# EAGLE design NANOEveryV3.0 (EAGLE 9.4.2)
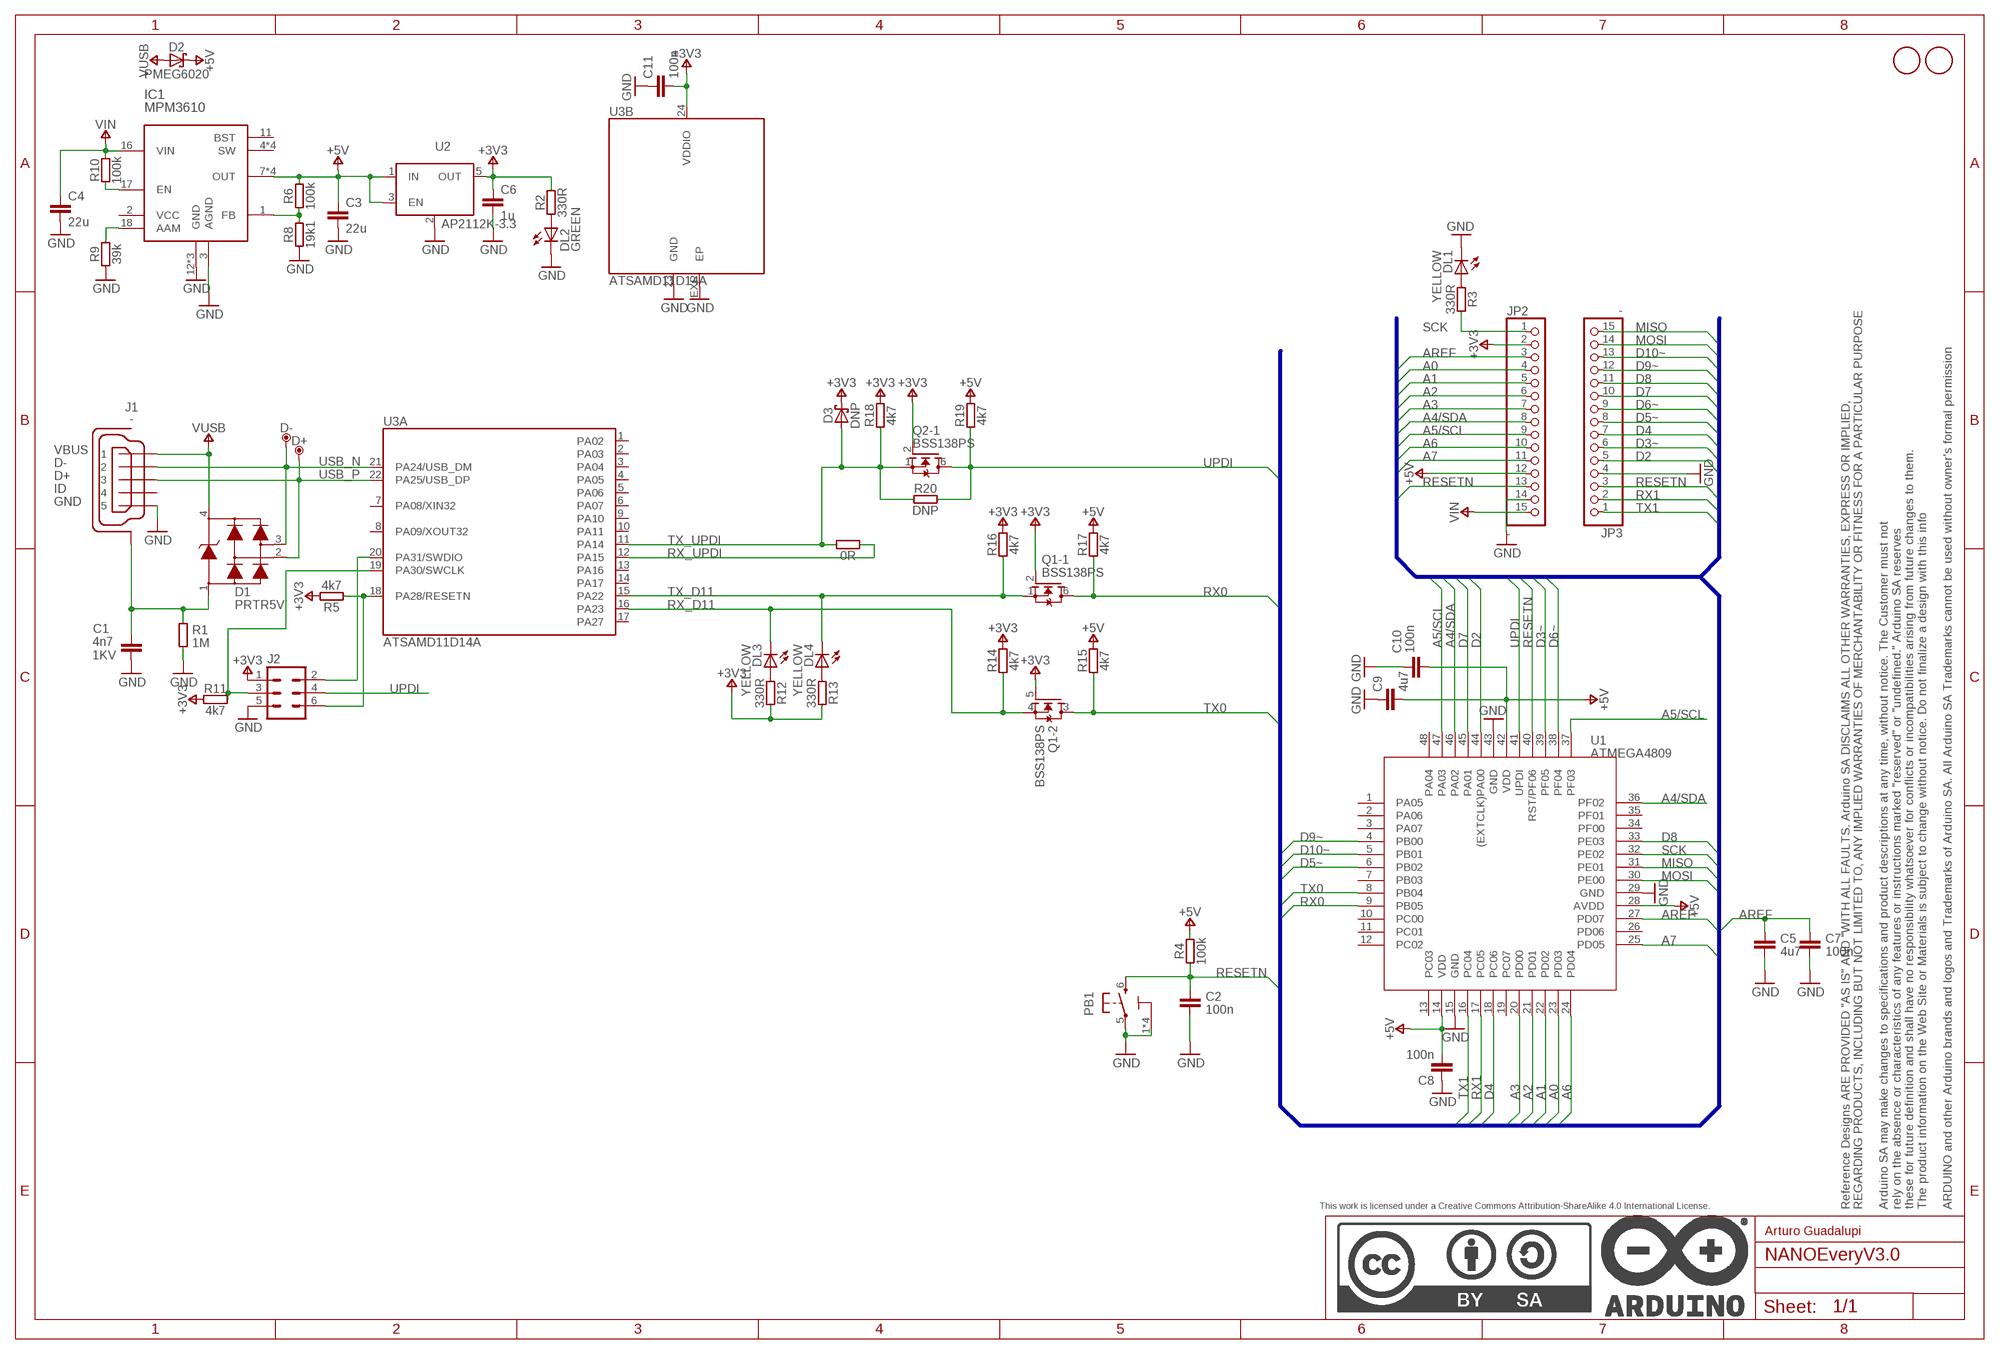
[diagram p0: schematic, sheet 1]

## Parts
C1  4n7  C4.7NF-0805  [0805-R2013X50N]
C2  100n  C-100NF-0402  [0402-1005X55N]
C3  22u  C-22U-0805  [0805-R2013X50N]
C4  22u  C-22U-0805  [0805-R2013X50N]
C5  4u7  C-4.7UF-0402  [0402-1005X55N]
C6  1u  C-1UF-0402  [0402-1005X55N]
C7  100n  C-100NF-0402  [0402-1005X55N]
C8  100n  C-100NF-0402  [0402-1005X55N]
C9  4u7  C-4.7UF-0402  [0402-1005X55N]
C10  100n  C-100NF-0402  [0402-1005X55N]
C11  100n  C-100NF-0402  [0402-1005X55N]
D1  PRTR5V  PRTR5V0U2X,215  [SOT190P230X110-4N]
D2  PMEG6020  PMEG6020AELRX  [SODFL3517X110N]
D3  DNP  PMEG6020AELRX-DNP  [SODFL3517X110N]
D+  DNP  TPTP-1.00MM  [TP-1.00MM]
D-  DNP  TPTP-1.00MM  [TP-1.00MM]
DL1  YELLOW  LED-YELLOW-0603  [LEDC1608X80N-AK]
DL2  GREEN  LED-GREEN-0603  [LEDC1608X80N-AK]
DL3  YELLOW  LED-YELLOW-0603  [LEDC1608X80N-AK]
DL4  YELLOW  LED-YELLOW-0603  [LEDC1608X80N-AK]
FD1  DNP  FIDUCIAL-1.5MM  [FD-1-1.5]
FD2  DNP  FIDUCIAL-1.5MM  [FD-1-1.5]
FRAME1  DNP  A3-FRAME  [FRAME]
IC1  MPM3610  [MPM3610]
J1  -  USB-MICRO  [ZX62-AB-5PA]
J2  DNP  PINHD-2X03-SMTP  [2X03-TP]
JP2  -  PINHD-1X15-CASTELLATED  [1X15-CASTELL]
JP3  -  PINHD-1X15-CASTELLATED  [1X15-CASTELL]
PB1  PTS820  TACTILE1PTS820-NH  [C&K_PTS820_NO_HOLES]
Q1  BSS138PS  [SOT363]
Q2  BSS138PS  [SOT363]
R1  1M  R-1M-0402  [0402-1005X55N]
R2  330R  R-330R-0402  [0402-1005X55N]
R3  330R  R-330R-0402  [0402-1005X55N]
R4  100k  R-100K-0402  [0402-1005X55N]
R5  4k7  R-4K7-0402  [0402-1005X55N]
R6  100k  R-100K-0402  [0402-1005X55N]
R7  0R  R-0R-0402  [0402-1005X55N]
R8  19k1  R-19K1-0402  [0402-1005X55N]
R9  39k  R-39K-0402  [0402-1005X55N]
R10  100k  R-100K-0402  [0402-1005X55N]
R11  4k7  R-4K7-0402  [0402-1005X55N]
R12  330R  R-330R-0402  [0402-1005X55N]
R13  330R  R-330R-0402  [0402-1005X55N]
R14  4k7  R-4K7-0402  [0402-1005X55N]
R15  4k7  R-4K7-0402  [0402-1005X55N]
R16  4k7  R-4K7-0402  [0402-1005X55N]
R17  4k7  R-4K7-0402  [0402-1005X55N]
R18  4k7  R-4K7-0402  [0402-1005X55N]
R19  4k7  R-4K7-0402  [0402-1005X55N]
R20  DNP  R-DNP-0402  [0402-1005X55N]
U1  ATMEGA4809  [TQFP48]
U2  AP2112K-3.3  [SOT25]
U3  ATSAMD11D14A  ATSAMD11D14  [HVQFN24]

## Nets
+3V3: C6.1 C11.2 D3.C J2.1 JP2.2 Q1.2(-1:G) Q1.5(-2:G) Q2.2(-1:G) R2.2 R5.2 R11.1 R12.2 R13.2 R14.2 R16.2 R18.2 U2.5(OUT) U3.24(B:VDDIO)
+5V: C3.1 C8.2 C9.2 C10.2 D2.C IC1.7(OUT) IC1.8(OUT) IC1.9(OUT) IC1.20(OUT) JP2.12 R4.2 R6.2 R15.2 R17.2 R19.2 U1.14(VDD) U1.28(AVDD) U1.42(VDD) U2.1(IN) U2.3(EN)
A0: JP2.4 U1.23(PD03)
A1: JP2.5 U1.22(PD02)
A2: JP2.6 U1.21(PD01)
A3: JP2.7 U1.20(PD00)
A4/SDA: JP2.8 U1.36(PF02) U1.46(PA02)
A5/SCL: JP2.9 U1.37(PF03) U1.47(PA03)
A6: JP2.10 U1.24(PD04)
A7: JP2.11 U1.25(PD05)
AREF: C5.1 C7.1 JP2.3 U1.27(PD07)
D2: JP3.5 U1.44((EXTCLK)PA00)
D3~: JP3.6 U1.39(PF05)
D4: JP3.7 U1.18(PC06)
D5~: JP3.8 U1.6(PB02)
D6~: JP3.9 U1.38(PF04)
D7: JP3.10 U1.45(PA01)
D8: JP3.11 U1.33(PE03)
D9~: JP3.12 U1.4(PB00)
D10~: JP3.13 U1.5(PB01)
D11_RESET: J2.6 R5.1 U3.18(A:PA28/RESETN)
D11_SWCLK: J2.3 R11.2 U3.19(A:PA30/SWCLK)
D11_SWDIO: J2.2 U3.20(A:PA31/SWDIO)
GND: C1.2 C2.2 C3.2 C4.2 C5.2 C6.2 C7.2 C8.1 C9.1 C10.1 C11.1 DL1.C DL2.C IC1.3(AGND) IC1.12(GND) IC1.13(GND) IC1.14(GND) J1.5 J2.5 JP2.14 JP3.4 PB1.1 PB1.2 PB1.3 PB1.4 PB1.5 R1.1 R8.1 R9.1 U1.15(GND) U1.29(GND) U1.43(GND) U2.2(GND/ADJ) U3.23(B:GND) U3.EXP(B:EP)
MISO: JP3.15 U1.31(PE01)
MOSI: JP3.14 U1.30(PE00)
N$1: C1.1 D1.1 J1.6(SH) J1.7(SH) J1.8(SH) J1.9(SH) J1.10(SH) J1.11(SH) R1.2
N$2: DL2.A R2.1
N$3: DL1.A R3.1
N$5: IC1.1(FB) R6.1 R8.2
N$6: IC1.18(AAM) R9.2
N$7: IC1.17(EN) R10.1
N$11: DL3.A R12.1
N$12: DL4.A R13.1
RESETN: C2.1 JP2.13 JP3.3 PB1.6 R4.1 U1.40(RST/PF06)
RX0: Q1.6(-1:D) R17.1 U1.9(PB05)
RX1: JP3.2 U1.17(PC05)
RX_D11: DL3.C Q1.4(-2:S) R14.1 U3.16(A:PA23)
RX_UPDI: R7.2 U3.12(A:PA15)
SCK: JP2.1 R3.2 U1.32(PE02)
TX0: Q1.3(-2:D) R15.1 U1.8(PB04)
TX1: JP3.1 U1.16(PC04)
TX_D11: DL4.C Q1.1(-1:S) R16.1 U3.15(A:PA22)
TX_UPDI: D3.A Q2.1(-1:S) R7.1 R18.1 R20.1 U3.11(A:PA14)
UPDI: J2.4 Q2.6(-1:D) R19.1 R20.2 U1.41(UPDI)
USB_N [usb]: D1.3 D-.X J1.2 U3.21(A:PA24/USB_DM)
USB_P [usb]: D1.2 D+.X J1.3 U3.22(A:PA25/USB_DP)
VIN: C4.1 IC1.16(VIN) JP2.15 R10.2
VUSB: D1.4 D2.A J1.1
Unconnected: IC1.2(VCC) IC1.4(SW) IC1.5(SW) IC1.6(SW) IC1.11(BST) IC1.19(SW) J1.4 Q2.3(-2:D) Q2.4(-2:S) Q2.5(-2:G) U1.1(PA05) U1.2(PA06) U1.3(PA07) U1.7(PB03) U1.10(PC00) U1.11(PC01) U1.12(PC02) U1.13(PC03) U1.19(PC07) U1.26(PD06) U1.34(PF00) U1.35(PF01) U1.48(PA04) U3.1(A:PA02) U3.2(A:PA03) U3.3(A:PA04) U3.4(A:PA05) U3.5(A:PA06) U3.6(A:PA07) U3.7(A:PA08/XIN32) U3.8(A:PA09/XOUT32) U3.9(A:PA10) U3.10(A:PA11) U3.13(A:PA16) U3.14(A:PA17) U3.17(A:PA27)

## Buses
A0,A1,A2,A3,A4/SDA,A5/SCL,A6,A7,AREF,D2,D3~,D4,D5~,D6~,D7,D8,D9~,D10~,MISO,MOSI,RESETN,RX0,RX1,SCK,TX1,UPDI,VIN

## Notes on the sheet
- Arturo Guadalupi

## Library data of the parts
C1 = Arduino-rcl:C: SMD Capacitor; CODE-ARDUINO: 0689; DATASHEET: http://www.kemet.com/Lists/ProductCatalog/Attachments/40/KEM_C1010_X7R_HV_SMD.pdf; DISTRIBUTOR-LINK: www.kemet.com/docfinder?Partnumber=C0805C472KDRACTU; DISTRIBUTOR-PN: 399-6738-1-ND; MANUFACTURER: Kemet; MANUFACTURER-PN: C0805C472KDRACTU; NOTE: -; VOLTAGE: 1KV
C2 C7 C8 C10 C11 = Arduino-rcl:C: SMD Capacitor; CODE-ARDUINO: 0132; DATASHEET: http://www.tdk.com/pdf/TDKMLCCCapRange.pdf; DISTRIBUTOR-LINK: http://www.digikey.com/product-detail/en/tdk-corporation/C1005X5R1H104K050BB/445-5942-1-ND/2443982; DISTRIBUTOR-PN: 445-5942-1-ND; MANUFACTURER: TDK; MANUFACTURER-PN: C1005X5R1H104K050BB; NOTE: -
C3 C4 = Arduino-rcl:C: SMD Capacitor; CODE-ARDUINO: 2233; DATASHEET: https://media.digikey.com/pdf/Data%20Sheets/Samsung%20PDFs/CL21A226MQCLQNC_character.pdf; DISTRIBUTOR-LINK: https://www.digikey.com/product-detail/en/samsung-electro-mechanics-america-inc/CL21A226MQCLQNC/1276-2412-1-ND/3890498; DISTRIBUTOR-PN: 1276-2412-1-ND; MANUFACTURER: Samsung; MANUFACTURER-PN: CL21A226MQCLQNC; NOTE: -
C5 C9 = Arduino-rcl:C: SMD Capacitor; CODE-ARDUINO: 0833; DATASHEET: http://search.murata.co.jp/Ceramy/image/img/A01X/partnumbering_e_01.pdf; DISTRIBUTOR-LINK: http://www.digikey.com/product-detail/en/murata-electronics-north-america/GRM155R60J475ME47D/490-5915-1-ND/3719860; DISTRIBUTOR-PN: 490-5915-1-ND; MANUFACTURER: Murata; MANUFACTURER-PN: GRM155R60J475ME47D; NOTE: -
C6 = Arduino-rcl:C: SMD Capacitor; CODE-ARDUINO: 0133; DATASHEET: http://search.murata.co.jp/Ceramy/image/img/A01X/partnumbering_e_01.pdf; DISTRIBUTOR-LINK: http://www.digikey.com/product-detail/en/murata-electronics-north-america/GRM155R61E105KA12D/490-10017-1-ND/5026367; DISTRIBUTOR-PN: 490-10017-1-ND; MANUFACTURER: Murata; MANUFACTURER-PN: GRM155R61E105KA12D; NOTE: -
D1 = Arduino-diodes:PRTR5V0U2X,215: USB ESD protection; CODE-ARDUINO: 2209; DATASHEET: http://www.nxp.com/documents/data_sheet/PRTR5V0U2X.pdf; DISTRIBUTOR-LINK: http://www.digikey.com/product-detail/en/nxp-semiconductors/PRTR5V0U2X,215/568-4140-1-ND/1589981; DISTRIBUTOR-PN: 568-4140-1-ND; MANUFACTURER: NXP; MANUFACTURER-PN: PRTR5V0U2X,215
D2 = Arduino-diodes:PMEG6020AELRX: 60 V, 2 A low leakage current Schottky barrier rectifier Datasheet <http://www.nxp.com/documents/data_sheet/PMEG6020AELR.pdf>; CODE-ARDUINO: 2208; DATASHEET: http://www.nxp.com/documents/data_sheet/PMEG6020AELR.pdf; DISTRIBUTOR-LINK: http://www.digikey.com/products/en?keywords=%20568-12710-1-ND; DISTRIBUTOR-PN: 568-12710-1-ND; MANUFACTURER: NXP; MANUFACTURER-PN: PMEG6020AELRX
D3 = Arduino-diodes:PMEG6020AELRX: 60 V, 2 A low leakage current Schottky barrier rectifier Datasheet <http://www.nxp.com/documents/data_sheet/PMEG6020AELR.pdf>; CODE-ARDUINO: DNP; DATASHEET: DNP; DISTRIBUTOR-LINK: DNP; DISTRIBUTOR-PN: DNP; MANUFACTURER: DNP; MANUFACTURER-PN: DNP
D+ D- = Arduino-utility:TP: Testpoint; CODE-ARDUINO: DNP; DATASHEET: DNP; DISTRIBUTOR-LINK: DNP; DISTRIBUTOR-PN: DNP; MANUFACTURER: DNP; MANUFACTURER-PN: DNP
DL1 DL3 DL4 = Arduino-diodes:LED: LED; CODE-ARDUINO: 2243; DATASHEET: http://media.digikey.com/pdf/Data%20Sheets/Avago%20PDFs/HSMz-Czzz.pdf; DISTRIBUTOR-LINK: http://www.digikey.com/product-detail/en/broadcom-limited/HSMY-C190/516-1424-1-ND/637748; DISTRIBUTOR-PN: 516-1424-1-ND; MANUFACTURER: Avago; MANUFACTURER-PN: HSMY-C190
DL2 = Arduino-diodes:LED: LED; CODE-ARDUINO: 2204; DATASHEET: http://media.digikey.com/pdf/Data%20Sheets/Avago%20PDFs/HSMz-Czzz.pdf; DISTRIBUTOR-LINK: http://www.digikey.com/product-detail/en/broadcom-limited/HSMG-C190/516-1425-1-ND/637749; DISTRIBUTOR-PN: 516-1425-1-ND; MANUFACTURER: Avago; MANUFACTURER-PN: HSMG-C190
FD1 FD2 = Arduino-utility:FIDUCIAL: Fiducial mount; CODE-ARDUINO: DNP; DATASHEET: DNP; DISTRIBUTOR-LINK: DNP; DISTRIBUTOR-PN: DNP; MANUFACTURER: DNP; MANUFACTURER-PN: DNP
FRAME1 = Arduino-utility:A3-FRAME; CODE-ARDUINO: DNP; DATASHEET: DNP; DISTRIBUTOR-LINK: DNP; DISTRIBUTOR-PN: DNP; MANUFACTURER: DNP; MANUFACTURER-PN: DNP; NOTE: DNP
IC1 = Arduino-ICs:MPM3610: MPM3610 Step Down Regulator; CODE-ARDUINO: 2093; DATASHEET: https://www.monolithicpower.com/pub/media/document/MPM3610_r1.01.pdf; DISTRIBUTOR-LINK: https://www.digikey.com/product-detail/en/monolithic-power-systems-inc/MPM3610AGQV-P/1589-1249-1-ND/5298336; DISTRIBUTOR-PN: 1589-1249-1-ND; MANUFACTURER: MPS; MANUFACTURER-PN: MPM3610AGQV-P; RESTRICTIONS: NO
J1 = Arduino-connectors:USB-MICRO: USB - micro AB USB 2.0 Receptacle Connector 5 Position Surface Mount, Right Angle, Horizontal; CODE-ARDUINO: 2219; DATASHEET: https://www.hirose.com/product/en/download_file/key_name/ZX/category/Catalog/doc_file_id/31704/?file_category_id=4&item_id=13&is_series=1; DISTRIBUTOR-LINK: http://www.digikey.com/product-detail/en/hirose-electric-co-ltd/ZX62-AB-5PA(31)/H125279CT-ND/5994741; DISTRIBUTOR-PN: H125279CT-ND; MANUFACTURER: Hirose; MANUFACTURER-PN: ZX62-AB-5PA(31)
J2 = Arduino-connectors:PINHD-2X03-SM: PIN HEADER; CODE-ARDUINO: DNP; DATASHEET: DNP; DISTRIBUTOR-LINK: DNP; DISTRIBUTOR-PN: DNP; MANUFACTURER: DNP; MANUFACTURER-PN: DNP; NOTE: DNP
JP2 JP3 = Arduino-connectors:PINHD-1X15: PIN HEADER; CODE-ARDUINO: 0646; DATASHEET: -; DISTRIBUTOR-LINK: -; DISTRIBUTOR-PN: -; MANUFACTURER: -; MANUFACTURER-PN: -; NOTE: DNM
PB1 = Arduino-pushbuttons:TACTILE1: Tactile Switch SPST-NO Top Actuated Surface Mount; CODE-ARDUINO: 0173; DATASHEET: http://www.ckswitches.com/media/1474/pts820.pdf; DISTRIBUTOR-LINK: https://www.digikey.com/product-detail/en/c-k/PTS820-J15M-SMTR-LFS/CKN10506CT-ND/4176681; DISTRIBUTOR-PN: PTS820 J25K SMTR LFS-ND; MANUFACTURER: C&K; MANUFACTURER-PN: PTS820 J25K SMTR LFS
Q1 Q2 = Arduino-transistors:BSS138PS: MOSFET 2N-CH 60V 0.32A 6TSSOP; CODE-ARDUINO: 2323; DATASHEET: https://assets.nexperia.com/documents/data-sheet/BSS138PS.pdf; DISTRIBUTOR-LINK: http://www.digikey.com/product-detail/en/nxp-semiconductors/BSS138PS,115/568-8393-1-ND/2763927; DISTRIBUTOR-PN: 568-8393-1-ND; MANUFACTURER: NXP; MANUFACTURER-PN: BSS138PS,115
R1 = Arduino-rcl:R: SMD Resistor; CODE-ARDUINO: 0139; DATASHEET: www.yageo.com.tw/exep/pages/download/literatures/PYu-R_INT-thick_7.pdf; DISTRIBUTOR-LINK: http://www.digikey.com/product-detail/en/yageo/RC0402JR-07330RL/311-330JRCT-ND/729412; DISTRIBUTOR-PN: 311-330JRCT-ND; MANUFACTURER: Yageo; MANUFACTURER-PN: RC0402JR-07330RL; NOTE: NO
R2 R3 R12 R13 = Arduino-rcl:R: SMD Resistor; CODE-ARDUINO: 2229; DATASHEET: www.yageo.com.tw/exep/pages/download/literatures/PYu-R_INT-thick_7.pdf; DISTRIBUTOR-LINK: http://www.digikey.com/product-detail/en/yageo/RC0402FR-07330RL/311-330LRCT-ND/729541; DISTRIBUTOR-PN: 311-330LRCT-ND; MANUFACTURER: Yageo; MANUFACTURER-PN: RC0402FR-07330RL; NOTE: NO
R4 R6 R10 = Arduino-rcl:R: SMD Resistor; CODE-ARDUINO: 0134; DATASHEET: www.yageo.com.tw/exep/pages/download/literatures/PYu-R_INT-thick_7.pdf; DISTRIBUTOR-LINK: http://www.digikey.com/product-detail/en/yageo/RC0402FR-07100KL/311-100KLRCT-ND/729473; DISTRIBUTOR-PN: 311-100KLRCT-ND; MANUFACTURER: Yageo; MANUFACTURER-PN: RC0402FR-07100KL; NOTE: NO
R5 R11 R14-R19 = Arduino-rcl:R: SMD Resistor; CODE-ARDUINO: 2196; DATASHEET: www.yageo.com.tw/exep/pages/download/literatures/PYu-R_INT-thick_7.pdf; DISTRIBUTOR-LINK: http://www.digikey.com/product-detail/en/yageo/RC0402FR-074K7L/311-4.7KLRCT-ND/2827881; DISTRIBUTOR-PN: 311-4.7KLRCT-ND; MANUFACTURER: Yageo; MANUFACTURER-PN: RC0402FR-074K7L; NOTE: NO
R7 = Arduino-rcl:R: SMD Resistor; CODE-ARDUINO: 0039; DATASHEET: www.yageo.com.tw/exep/pages/download/literatures/PYu-R_INT-thick_7.pdf; DISTRIBUTOR-LINK: http://www.digikey.com/product-detail/en/yageo/RC0402FR-070RL/311-0.0LRCT-ND/2827888; DISTRIBUTOR-PN: 311-0.0LRCT-ND; MANUFACTURER: Yageo; MANUFACTURER-PN: RC0402FR-070RL; NOTE: NO
R8 = Arduino-rcl:R: SMD Resistor; CODE-ARDUINO: A5369; DATASHEET: http://www.yageo.com/documents/recent/PYu-RC_Group_51_RoHS_L_10.pdf; DISTRIBUTOR-LINK: https://www.digikey.it/product-detail/it/yageo/RC0402FR-0719K1L/311-19.1KLRTR-ND/726552; DISTRIBUTOR-PN: 311-19.1KLRTR-ND; MANUFACTURER: Yageo; MANUFACTURER-PN: RC0402FR-0719K1L; NOTE: NO
R9 = Arduino-rcl:R: SMD Resistor; CODE-ARDUINO: A5479; DATASHEET: www.yageo.com.tw/exep/pages/download/literatures/PYu-R_INT-thick_7.pdf; DISTRIBUTOR-LINK: https://www.digikey.com/product-detail/en/yageo/RC0402JR-0739KL/311-39KJRCT-ND/729420; DISTRIBUTOR-PN: 311-39KJRCT-ND; MANUFACTURER: Yageo; MANUFACTURER-PN: RC0402JR-0739KL; NOTE: NO
R20 = Arduino-rcl:R: SMD Resistor; CODE-ARDUINO: DNP; DATASHEET: DNP; DISTRIBUTOR-LINK: DNP; DISTRIBUTOR-PN: DNP; MANUFACTURER: DNP; MANUFACTURER-PN: DNP; NOTE: NO
U1 = Arduino-ucs&SoCs:ATMEGA4809: ATMEGA4809; CODE-ARDUINO: ATMEGA4809; DATASHEET: http://ww1.microchip.com/downloads/en/DeviceDoc/40002016A.pdf; DISTRIBUTOR-LINK: https://www.digikey.com/product-detail/en/microchip-technology/ATMEGA4809-AFR/ATMEGA4809-AFRCT-ND/8540756; DISTRIBUTOR-PN: ATMEGA4809-AFRCT-ND; MANUFACTURER: Microchip; MANUFACTURER-PN: ATMEGA4809-AFR
U2 = Arduino-ICs:AP2112K-3.3: IC REG LINEAR 3.3V 600mA SOT25; CODE-ARDUINO: 2199; DATASHEET: https://www.diodes.com/assets/Datasheets/AP2112.pdf; DISTRIBUTOR-LINK: https://www.digikey.com/product-detail/en/diodes-incorporated/AP2112K-3.3TRG1/AP2112K-3.3TRG1DITR-ND/4470746; DISTRIBUTOR-PN: AP2112K-3.3TRG1DITR-ND; MANUFACTURER: Diodes Inc; MANUFACTURER-PN: AP2112K-3.3TRG1; NOTE: NO
U3 = Arduino-ucs&SoCs:ATSAMD11D14: IC MCU 32BIT 16KB FLASH 24QFN; CODE-ARDUINO: ATSAM-D11-D14A-MUT; DATASHEET: http://ww1.microchip.com/downloads/en/DeviceDoc/Atmel-42363-SAM-D11_Datasheet.pdf; DISTRIBUTOR-LINK: https://www.digikey.com/product-detail/it/microchip-technology/ATSAMD11D14A-MUT/ATSAMD11D14A-MUTCT-ND/5226480; DISTRIBUTOR-PN: ATSAMD11D14A-MUTCT-ND; MANUFACTURER: Microchip; MANUFACTURER-PN: ATSAMD11D14A-MUT

## Net classes
0 default: width 0.19 mm, drill 0.19 mm
1 usb: width 0.19 mm, drill 0.19 mm, clearance 0.127 mm

## Board
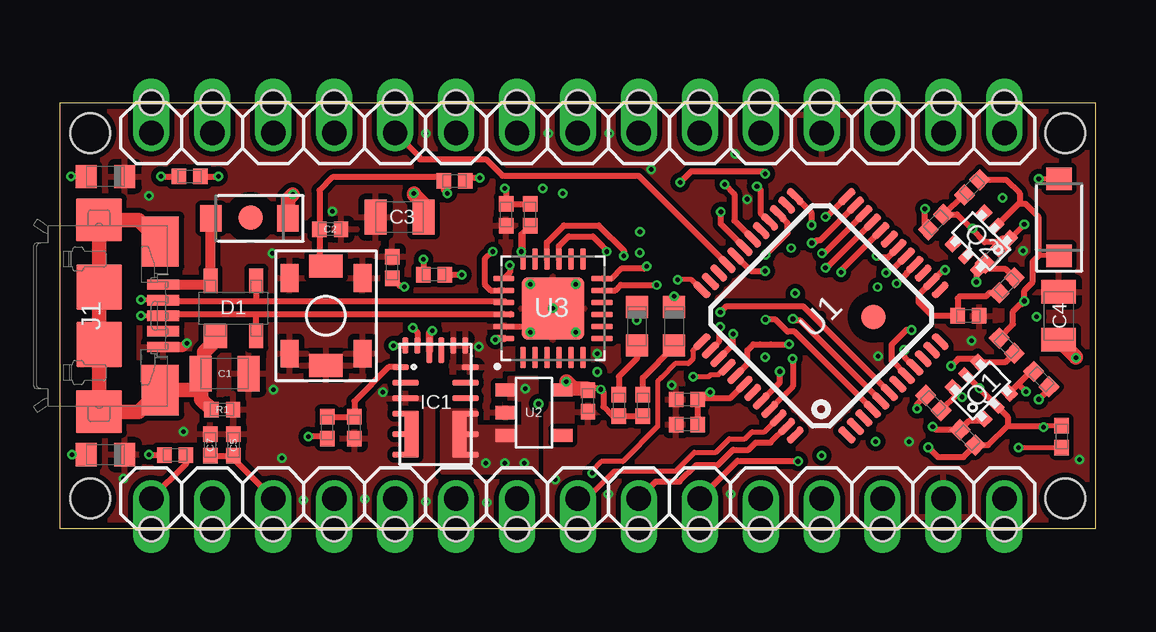
[diagram p1: board, top side]
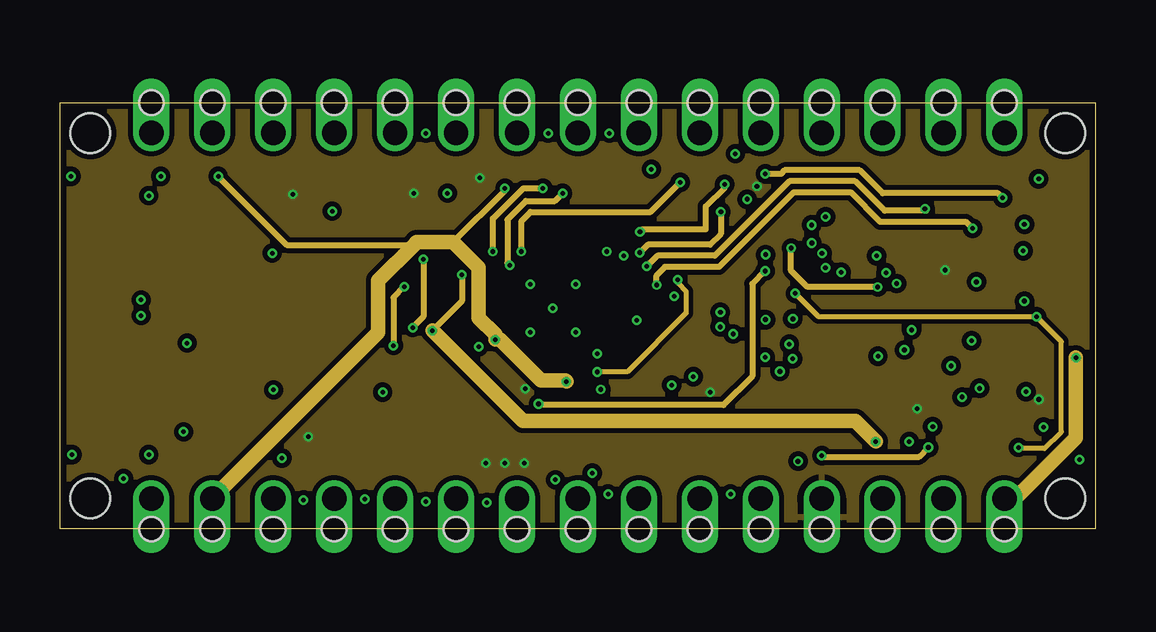
[diagram p2: board, inner layer PWR]
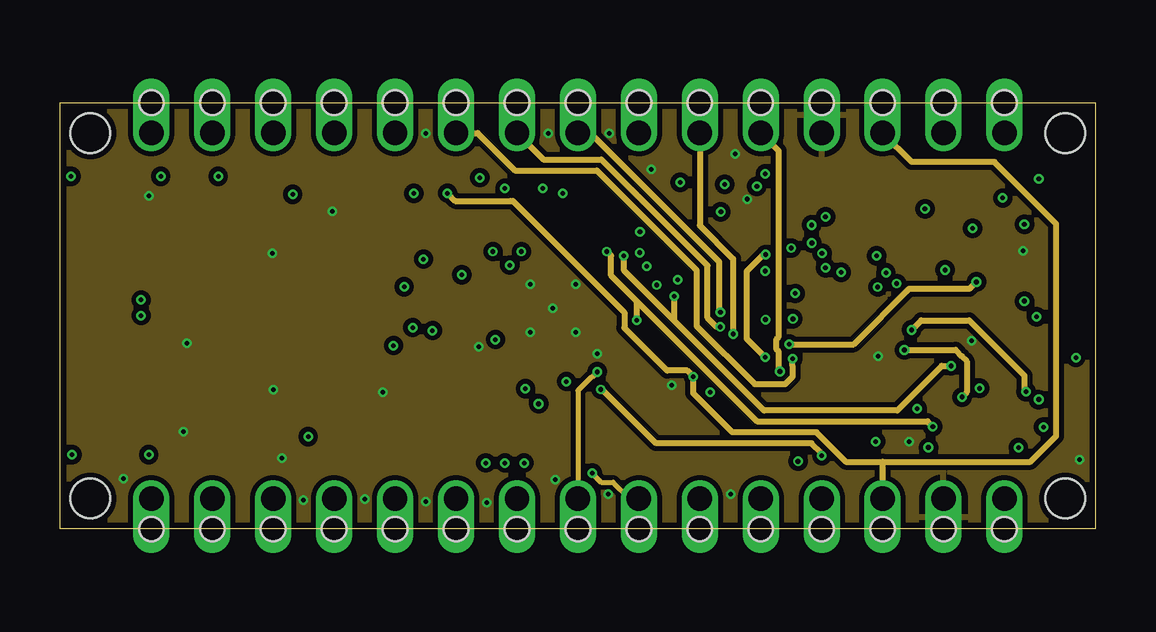
[diagram p3: board, inner layer MID]
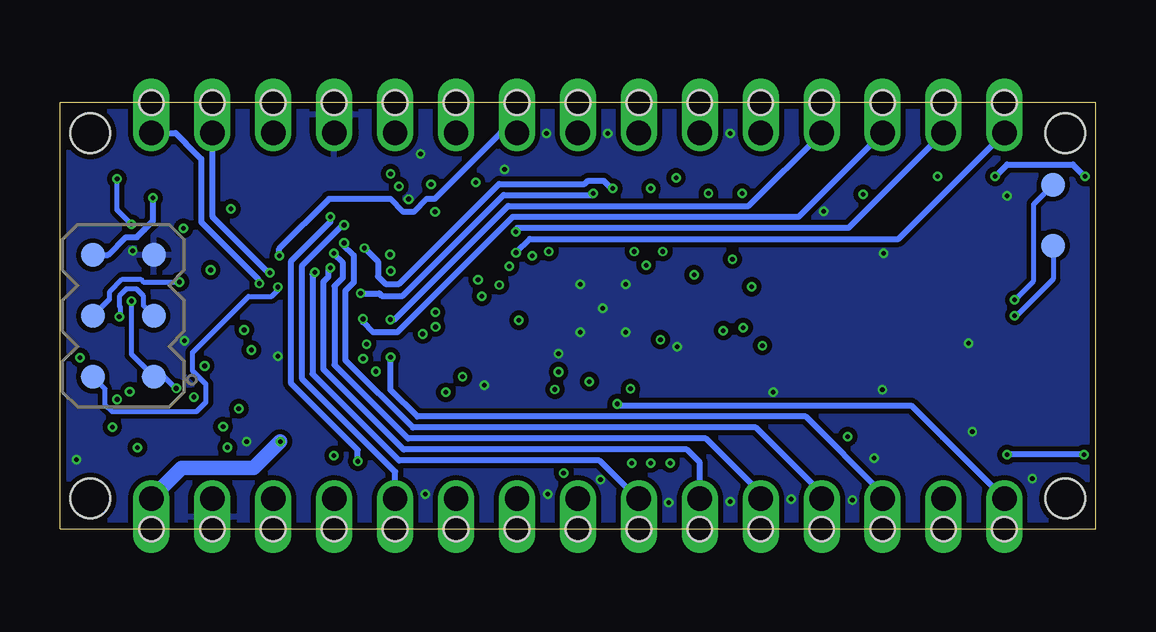
[diagram p4: board, bottom side, seen from below]

Size 43.18 x 17.78 mm. Coordinates in mm from the lower left corner, seen from the top.
Outline: 0,0 0,17.78 43.18,17.78 43.18,0 0,0
Copper layers (1*2*15*16): Top 0.035mm / dielectric 0.2mm / PWR 0.0175mm / dielectric 0.3mm / MID 0.0175mm / dielectric 0.2mm / Bottom 0.035mm
Design rules "SeeedStudio_4layers *": minimum track width 8mil, minimum drill 0.19mm, track to track 8mil, track to pad 8mil, pad to pad 8mil, via to via 8mil, smd to smd 0mil, copper to edge 10mil, drill to drill 8mil, minimum pad ring 6mil, minimum via ring 4mil, stop-mask expansion 4mil, vias tented up to drill 25mil, thermal gap 10mil
Holes 1.65 mm at 1.27,16.51 1.27,1.27 41.91,1.27 41.91,16.51

### Footprints (pad centres in the part's own frame; a part is rotated, then mirrored left to right if it is on the bottom)
0805-R2013X50N = smd 0.95 x 1.45: 1 -1,0; 2 1,0
0402-1005X55N = smd 0.62 x 0.62: 1 -0.45,0; 2 0.45,0
SOT190P230X110-4N = smd 1 x 1: 1 -1.15,0.75 | smd 1 x 0.6: 2 -1.15,-0.95; 3 1.15,-0.95; 4 1.15,0.95
SODFL3517X110N = smd 0.91 x 1.07: A 1.605,0; C -1.605,0
TP-1.00MM = smd 1 x 1 bottom: X 0,0
LEDC1608X80N-AK = smd 0.9 x 0.95: A 0.8,0; C -0.8,0
FD-1-1.5 = smd 1.016 x 1.016: P$1 0,0
MPM3610 = smd 0.7 x 0.25: 1 -1.45,1.55; 4 -1.45,-0.4; 5 -1.45,-1.25; 6 -1.45,-2.1; 7 1.45,-2.1; 8 1.45,-1.25; 9 1.45,-0.4; 12 1.45,1.55 | smd 1.1 x 0.25: 2 -1.25,0.9; 3 -1.25,0.25; 10 1.25,0.25; 11 1.25,0.9 | smd 0.25 x 0.7: 13 1.25,2.45; 14 0.75,2.45; 17 -0.75,2.45; 18 -1.25,2.45 | smd 0.25 x 1.1: 15 0.25,2.25; 16 -0.25,2.25 | smd 0.6 x 1.95: 19 -1,-1.25; 20 1,-1.25
ZX62-AB-5PA = smd 0.4 x 1.35: 1 -1.3,3.025; 2 -0.65,3.025; 3 0,3.025; 4 0.65,3.025; 5 1.3,3.025 | smd 2.1 x 1.6: 6 3.1,2.9; 11 -3.1,2.9 | smd 1.8 x 1.9: 7 4,0.35; 10 -4,0.35 | smd 1.9 x 1.9: 8 1.2,0.35; 9 -1.2,0.35
2X03-TP = smd 1 x 1 bottom: 1 -2.54,1.27; 2 -2.54,-1.27; 3 0,1.27; 4 0,-1.27; 5 2.54,1.27; 6 2.54,-1.27
1X15-CASTELL = drill 1.016 offset: 1 -17.78,0; 2 -15.24,0; 3 -12.7,0; 4 -10.16,0; 5 -7.62,0; 6 -5.08,0; 7 -2.54,0; 8 0,0; 9 2.54,0; 10 5.08,0; 11 7.62,0; 12 10.16,0; 13 12.7,0; 14 15.24,0; 15 17.78,0 | hole 1.016: 17.78,-1.27; 15.24,-1.27; 12.7,-1.27; 10.16,-1.27; 7.62,-1.27; 5.08,-1.27; 2.54,-1.27; 0,-1.27; -2.54,-1.27; -5.08,-1.27; -7.62,-1.27; -10.16,-1.27; -12.7,-1.27; -15.24,-1.27; -17.78,-1.27
C&K_PTS820_NO_HOLES = smd 1.15 x 0.75: 1 -1.575,1.525; 2 -1.575,-1.525; 3 1.575,1.525; 4 1.575,-1.525 | smd 0.95 x 1.4: 5 -2.075,0; 6 2.075,0
SOT363 = smd 0.5 x 0.6: 1 -0.75,-0.9; 3 0.75,-0.9; 4 0.75,0.9; 6 -0.75,0.9 | smd 0.4 x 0.6: 2 0,-0.9; 5 0,0.9
TQFP48 = smd 0.85 x 0.32: 1 -4.275,2.75; 2 -4.275,2.25; 3 -4.275,1.75; 4 -4.275,1.25; 5 -4.275,0.75; 6 -4.275,0.25; 7 -4.275,-0.25; 8 -4.275,-0.75; 9 -4.275,-1.25; 10 -4.275,-1.75; 11 -4.275,-2.25; 12 -4.275,-2.75; 25 4.275,-2.75; 26 4.275,-2.25; 27 4.275,-1.75; 28 4.275,-1.25; 29 4.275,-0.75; 30 4.275,-0.25; 31 4.275,0.25; 32 4.275,0.75; 33 4.275,1.25; 34 4.275,1.75; 35 4.275,2.25; 36 4.275,2.75 | smd 0.32 x 0.85: 13 -2.75,-4.275; 14 -2.25,-4.275; 15 -1.75,-4.275; 16 -1.25,-4.275; 17 -0.75,-4.275; 18 -0.25,-4.275; 19 0.25,-4.275; 20 0.75,-4.275; 21 1.25,-4.275; 22 1.75,-4.275; 23 2.25,-4.275; 24 2.75,-4.275; 37 2.75,4.275; 38 2.25,4.275; 39 1.75,4.275; 40 1.25,4.275; 41 0.75,4.275; 42 0.25,4.275; 43 -0.25,4.275; 44 -0.75,4.275; 45 -1.25,4.275; 46 -1.75,4.275; 47 -2.25,4.275; 48 -2.75,4.275 | smd 0 x 0: EP 0,0
SOT25 = smd 0.55 x 0.8: 1 0.95,1.2; 2 0,1.2; 3 -0.95,1.2; 4 -0.95,-1.2; 5 0.95,-1.2
HVQFN24 = smd 0.24 x 0.9: 1 -1.25,-2.05; 2 -0.75,-2.05; 3 -0.25,-2.05; 4 0.25,-2.05; 5 0.75,-2.05; 6 1.25,-2.05; 13 1.25,2.05; 14 0.75,2.05; 15 0.25,2.05; 16 -0.25,2.05; 17 -0.75,2.05; 18 -1.25,2.05 | smd 0.9 x 0.24: 7 2.05,-1.25; 8 2.05,-0.75; 9 2.05,-0.25; 10 2.05,0.25; 11 2.05,0.75; 12 2.05,1.25; 19 -2.05,1.25; 20 -2.05,0.75; 21 -2.05,0.25; 22 -2.05,-0.25; 23 -2.05,-0.75; 24 -2.05,-1.25 | smd 2.6 x 2.6: EXP 0,0

### Placement (x,y rotation side)
C1  6.87,6.47 0 top
C2  11.27,12.5 0 top
C3  14.16,13 180 top
C4  41.62,8.89 90 top
C5  7.24,3.5 90 top
C6  22.01,5.34 270 top
C7  6.26,3.5 90 top
C8  37.87,8.89 180 top
C9  26.13,4.36 0 top
C10  26.13,5.4 0 top
C11  18.6,13.1 90 top
D1  7.23,9.2 90 top
D2  7.9,12.95 180 top
D3  41.65,13 90 top
D+  1.78,11.81 0 top
D-  1.78,14.35 0 top
DL1  1.9,3.1 180 top
DL2  1.9,14.7 180 top
DL3  25.6,8.45 270 top
DL4  24.05,8.45 270 top
FD1  7.94,12.99 0 top
FD2  33.9,8.83 0 top
FRAME1  0.15,-3.2 0 top  (outside the outline)
IC1  15.65,5.2 0 top
J1  1.28,8.89 270 top
J2  40.54,8.89 90 top
JP2  21.59,1.27 0 top
JP3  21.59,16.51 180 top
PB1  11.09,8.89 90 top
Q1  38.4,5.78 45 top
Q2  38.4,12 135 top
R1  6.77,4.97 180 top
R2  5.4,14.7 0 top
R3  4.8,3.09 0 top
R4  16.45,14.51 0 top
R5  19.6,13.1 90 top
R6  11.14,4.22 270 top
R7  36.51,12.79 225 top
R8  12.28,4.22 90 top
R9  13.85,10.9 270 top
R10  15.6,10.6 0 top
R11  41.75,3.85 270 top
R12  24.3,5.15 270 top
R13  23.3,5.15 270 top
R14  39.46,7.64 135 top
R15  40.91,6.25 315 top
R16  37.84,3.81 315 top
R17  36.4,5.25 135 top
R18  38.02,14.25 45 top
R19  39.46,10.16 225 top
R20  38.89,11.39 225 top
U1  31.73,8.89 135 top
U2  19.76,4.85 90 top
U3  20.55,9.2 0 top

### Tracks (layer width: path | path; a pad name or v marks a point on that pad's centre or on a via)
+3V3  (via drill 0.19, 0.2)
  Top 0.203: R11.1 41.05,4.3 v41,4.25 | D3.C 40.8,11.39 40.8,11.4 | v38.33,5.87 38.26,5.94 38.24,5.94
  Top 0.254: R5.2 C11.2 18.6,14.15 v18.55,14.2 | R2.2 v6.6,14.7 | C6.1 22.01,5.87 22.5,5.87 v22.55,5.82 22.65,5.72 22.65,5.1 23.05,4.7 R13.2 R12.2 | U2.5 21.11,5.95 v21.11,6.15 | Q1.5 38.24,5.94 Q1.2 39.5,4.68 39.5,4.3 | 39.5,4.3 38.7,3.5 R16.2 37.66,3 36.6,3 v36.2,3.4 | 39.5,4.3 40.95,4.3 v41,4.25 | R14.2 39.72,8.54 39.72,9.07 40.03,9.38 40.08,9.38 v40.2,9.5 40.2,9.95 40.55,10.3 40.55,11.15 40.8,11.4 40.8,13 40.25,13.55 39.95,13.55 | R18.2 39.43,14.57 40,14 40,13.6 39.95,13.55 | 39.95,13.55 Q2.2
  Top 0.305: U3.24 18.15,7.95 18.1,7.9 v18.15,7.9
  Top 0.61: v21.11,6.15 21.41,5.85 21.95,5.85 C6.1
  PWR 0.254: 16.39,11.96 18.55,14.11 v18.55,14.2 | v6.6,14.7 9.45,11.85 14.75,11.85 | v31.76,3.06 31.8,3.02 35.81,3.02 v36.2,3.4
  PWR 0.61: JP2.2 13.27,8.19 13.27,10.36 14.75,11.85 14.86,11.96 16.39,11.96 17.45,10.89 17.45,8.79 18.15,8.1 v18.15,7.9 18.35,7.9 20.05,6.2 21.06,6.2 v21.11,6.15
  MID 0.254: v22.55,5.82 22.6,5.82 24.85,3.57 31.33,3.57 31.76,3.14 v31.76,3.06
  Bottom 0.203: v38.33,5.87 38.37,5.87 38.85,6.35 J2.1 40.2,7.28 v40.2,9.5
+5V  (via drill 0.19, 0.2)
  Top 0.254: C10.2 26.58,5.45 27.15,5.45 | C10.2 C9.2 | U1.42 27.93,5.45 27.15,5.45 | R6.2 11.06,3.85 v10.35,3.85 | R4.2 17.04,14.65 v17.5,14.65 | 27.15,5.45 27.15,5.65 v27.1,5.7 26.81,5.4 C10.2 | R19.2 38.75,9.85 38.6,9.7 37.5,9.7 37.42,9.62 C8.2 37.41,8.88 36.37,8.88 35.8,9.45 35.8,9.78 U1.14 36.82,10.8 v36.9,10.8 | R17.2 35.73,5.21 v35.73,5.02 | R15.2 41.23,5.83 v40.8,5.4 | U1.28 29.2,13.18 29.2,14.14 v29.05,14.29
  Top 0.61: C3.1 15.16,13.54 14.75,13.95 v14.75,13.99 | D2.C 9.51,13.76 v9.7,13.95
  other vias: 17.75,2.75 18.55,2.75 19.35,2.75 19.4,5.85
  pour PWR: 0,18 43.18,18 43.18,0 0,0
  pour Top (rank 5, no thermals): 15.95,4.95 17.3,4.95 17.3,4.25 19.35,4.25 19.35,5.4 18.75,5.4 18.75,6.3 19.85,6.3 19.85,2.35 15.95,2.35
A0  (via drill 0.2)
  Top 0.254: v31.34,11.92 31.44,11.92 31.55,12.03 31.68,12.03 U1.23
  Bottom 0.254: v31.34,11.92 31.37,11.89 31.41,11.89 30.92,11.4 30.92,10.29 31.28,9.94 31.28,7.04 28.47,4.23 14.17,4.23 11.43,1.49 JP2.4
A1  (via drill 0.2)
  Top 0.254: U1.22 31.87,11.51 31.78,11.51 v31.77,11.49
  Bottom 0.254: v31.77,11.49 | v31.77,11.49 31.38,11.11 31.38,10.48 31.73,10.13 31.73,6.85 28.66,3.77 16.25,3.77 13.97,1.49 JP2.5
A2  (via drill 0.2)
  Top 0.254: U1.21 31.96,10.89 v31.91,10.89
  Bottom 0.254: v31.91,10.89 31.99,10.81 31.99,10.52 32.19,10.32 32.19,6.66 28.85,3.31 17.05,3.31 16.51,2.77 JP2.6
A3  (via drill 0.2)
  Top 0.254: U1.20 32.54,10.76 32.54,10.72 v32.56,10.7
  Bottom 0.254: v32.56,10.7 32.65,10.61 32.65,6.47 29.04,2.86 20.7,2.86 19.11,1.27 JP2.7
A4/SDA  (via drill 0.2)
  Top 0.203: U1.36 26.33,10.4 v25.75,10.4 v25.75,10.39 | U1.46 29.37,4.06 28.85,4.06 28.55,3.76 27.9,3.76 27.8,3.65 27.34,3.2 26.44,3.2 25.65,2.41 23.1,2.41 21.96,1.27 JP2.8
  PWR 0.203: v25.75,10.39 25.75,10.26 26.1,9.91 26.1,9 23.65,6.55 v22.4,6.55
  MID 0.203: v22.4,6.55 22.17,6.32 22.14,6.32 21.59,5.77 JP2.8
A5/SCL  (via drill 0.2)
  Top 0.203: U1.37 26.38,7.43 26.38,7.08 26.19,6.89 25.64,6.89 25.07,6.33 25,6.25 24.91,6.17 24.91,4.27 23.46,2.81 22.56,2.81 22.15,2.4 22.18,2.37 v22.18,2.33
  Top 0.254: U1.47 29.62,3.6 29,3.6 28.7,3.3 28.05,3.3 27.43,2.67 26.53,2.67 25.83,1.98 24.84,1.98 JP2.9
  MID 0.203: v22.18,2.33 22.56,1.95 23.06,1.95 23.74,1.27 JP2.9
A6  (via drill 0.2)
  Top 0.254: v30.77,2.82 30.77,2.84 28.24,2.84 JP2.10 | v31.91,13.02 31.97,13.02 U1.24
  Bottom 0.254: v30.77,2.82 30.77,3.29 33.56,6.09 33.56,11.15 31.91,12.8 v31.91,13.02
A7  (via drill 0.2)
  Top 0.254: v31.34,12.68 31.34,13.17 U1.25
  Bottom 0.254: v31.34,12.68 31.39,12.68 33.11,10.96 33.11,6.28 29.21,2.38 JP2.11
AREF  (via drill 0.2)
  Top 0.254: U1.27 29.94,13.14 30.33,12.75 30.33,12.35 v29.42,11.44 | C7.1 C5.1 7.24,2.92 JP2.3
  MID 0.254: v29.4,7.16 28.63,7.93 28.63,10.75 29.32,11.44 v29.42,11.44
  Bottom 0.254: v29.4,7.16 29.4,5.8 28.28,4.69 12.09,4.69 8.89,1.49 JP2.3
D2  (via drill 0.2)
  Top 0.254: U1.44 30,6.1 v30,6.56 v30.01,6.57
  MID 0.254: v30.01,6.57 29.96,6.62 29.96,7.4 29.87,7.48 29.87,7.92 29.96,8.01 29.96,15.76 JP3.5
D3~  (via drill 0.2)
  Top 0.254: U1.39 28.03,7.67 28.04,7.67 28.06,7.69 v28.06,8.13
  MID 0.254: v28.06,8.13 28.06,11.26 26.67,12.65 JP3.6
D4  (via drill 0.2)
  Top 0.254: U1.18 34.5,11.31 34.12,11.31 v34.04,11.39
  Bottom 0.254: v34.04,11.39 34.04,11.69 31.97,13.76 29.41,13.76 28.87,13.22 28.43,13.22 27.89,13.76 27.57,13.76 24.82,16.51 JP3.7
D5~  (via drill 0.2)
  Top 0.254: v27.53,9.04 27.78,9.29 30.97,9.29 U1.6
  MID 0.254: v27.53,9.04 27.48,9.09 27.48,11.15 22.12,16.51 JP3.8
D6~  (via drill 0.2)
  Top 0.254: U1.38 27.48,7.83 27.48,8.43 v27.52,8.43
  MID 0.254: v27.52,8.43 27.37,8.43 27,8.8 27,10.98 22.57,15.41 20.15,15.41 JP3.9
D7  (via drill 0.2)
  Top 0.254: U1.45 29.59,5 30.54,5.95 v30.54,7.1
  MID 0.254: v30.54,7.1 30.54,7.06 30.54,6.79 30.54,6.35 30.23,6.04 28.96,6.04 26.54,8.46 26.54,10.79 22.38,14.95 18.97,14.95 17.41,16.51 JP3.10
D8
  Top 0.254: JP3.11 15,15.48 15,15.42 17.75,15.42 18.44,14.73 24.12,14.73 U1.33
D9~  (via drill 0.2)
  Top 0.254: v29.41,8.73 29.83,8.73 30.33,8.23 30.62,8.23 U1.4
  Bottom 0.254: JP3.12 14.47,13.47 24.5,13.47 29.24,8.73 v29.41,8.73
D10~  (via drill 0.2)
  Top 0.254: v30.55,8.76 30.62,8.69 30.87,8.69 U1.5
  Bottom 0.254: JP3.13 12.39,13.01 24.31,13.01 29.12,8.2 30.12,8.2 30.55,8.63 v30.55,8.76
D11_RESET  (via drill 0.19)
  Top 0.203: R5.1 19.3,12.35 U3.18
  Top 0.254: R5.1 19.24,12.29 v19.24,11.57 | v25.85,14.45 26.3,14.9 29.4,14.9 v29.4,14.81
  PWR 0.254: v39.3,13.8 39.1,14 34.3,14 33.34,14.96 30.21,14.96 30.06,14.81 v29.4,14.81 | v19.24,11.57 19.24,12.84 19.61,13.22 24.62,13.22 v25.85,14.45
  Bottom 0.254: v39.3,13.8 39.3,12.85 39.67,12.48 39.98,12.17 40.43,12.17 41.17,11.43 J2.6
D11_SWCLK  (via drill 0.19, 0.2)
  Top 0.203: v39.95,3.4 R11.2
  Top 0.254: v18.75,11 18.75,10.7 U3.19
  PWR 0.203: v39.95,3.4 40,3.4 40.05,3.35 41.04,3.35 41.74,4.05 41.74,7.82 v40.71,8.85 31.62,8.85 v30.65,9.82
  PWR 0.254: v20.95,13.99 20.63,13.67 19.42,13.67 18.65,12.9 18.65,11.1 v18.75,11
  Bottom 0.203: v40.71,8.85 40.67,8.89 40.67,9.25 40.71,9.29 40.71,9.71 40.41,10.01 39.99,10.01 39.69,9.71 39.69,9.31 J2.3
  Bottom 0.254: v30.65,9.82 29.86,9.82 29.76,9.72 28.89,9.72 24.69,13.93 21,13.93 20.95,13.97 v20.95,13.99
D11_SWDIO  (via drill 0.19)
  Top 0.254: v18.05,11.57 18,11.57 17.7,11.27 17.7,10.2 17.95,9.95 18.3,9.95 U3.20
  PWR 0.254: v34.09,10.09 31.16,10.09 30.45,10.8 30.45,11.68 v30.49,11.71 | v18.05,11.57 18.05,12.95 19.3,14.2 v20.13,14.2
  Bottom 0.203: v34.09,10.09 34.09,9.96 34.35,9.7 35.32,9.7 37.66,7.36 37.66,6.59 37.09,6.03 37.09,5.29 37.49,4.89 41.01,4.89 41.31,5.19 41.31,5.85 J2.2
  Bottom 0.254: v30.49,11.71 29.93,11.15 29.93,10.54 29.61,10.22 29.04,10.22 24.88,14.38 21.31,14.38 21.17,14.52 20.52,14.52 20.2,14.2 v20.13,14.2
GND  (via drill 0.19, 0.2)
  Top 0.254: U3.23 19.8,8.45 U3.EXP
  Top 0.406: J1.5 5.14,7.59 v5.3,7.75
  other vias: 8.9,5.8 3.7,13.9 5.15,4.05 2.65,2.1 8.85,11.5 11.35,13.25 22.85,1.45 27.95,1.45 28.15,15.65 24.65,15 35.4,3.65 13.45,5.7 17.45,7.6 9.25,2.95 12.7,1.25 10.15,1.2 15.25,1.15 17.8,1.1 15.25,16.5 20.35,16.5 22.9,16.5 42.5,2.9 38,7.85 40.15,11.6 34.1,7.2 22.4,7.3 19.6,8.2 19.6,10.2 21.5,10.2 21.5,8.2 20.55,9.2 20.65,2.05 25.5,6 28.65,13.75
  pour Bottom: 0,18 43.18,18 43.18,0 0,0 0,17
  pour Top (rank 6): 0,18 43.18,18 43.18,0 0,0
  pour MID: 0.05,18 43.18,18 43.18,0 0,0 0,17.8
MISO  (via drill 0.2)
  Top 0.254: U1.31 27.55,12.71 v27.55,13.22
  PWR 0.254: v27.55,13.22 27.55,12.3 27.1,11.86 24.51,11.86 v24.17,11.52
  Bottom 0.254: JP3.15 8.22,12.1 23.59,12.1 v24.17,11.52
MOSI  (via drill 0.2)
  Top 0.254: U1.30 28.11,12.86 28.11,13.97 v27.71,14.37
  PWR 0.254: v24.18,12.39 24.28,12.49 26.91,12.49 26.91,13.45 27.71,14.24 v27.71,14.37
  Bottom 0.254: JP3.14 10.31,12.55 24.12,12.55 24.23,12.44 v24.18,12.39
N$1
  Top 0.61: J1.11 3.28,12.89 J1.10 J1.9 J1.8 J1.7 3.28,4.89 J1.6 5.89,5.79 | 5.89,5.79 5.9,5.8 5.87,5.83 C1.1 6.02,6.62 6.02,7.39 6.48,7.85 D1.1 | R1.2 5.89,5.4 5.89,5.79
N$2  (via drill 0.19)
  Top 0.254: DL2.A v0.46,14.7 | v4.2,14.7 R2.1
  Bottom 0.254: v4.2,14.7 3.7,15.2 0.96,15.2 v0.46,14.7
N$3  (via drill 0.19)
  Top 0.254: DL1.A v0.5,3.1 | v3.7,3.1 3.71,3.09 R3.1
  Bottom 0.254: v0.5,3.1 v3.7,3.1
N$5
  Top 0.254: R6.1 R8.2 12.28,5.33 13.7,6.75 IC1.1
N$6  (via drill 0.19)
  Top 0.254: R9.2 14.15,10.15 14.35,10.15 v14.35,10.1 | v13.9,7.65 IC1.18
  PWR 0.254: v14.35,10.1 13.9,9.65 v13.9,7.65
N$7  (via drill 0.19)
  Top 0.254: IC1.17 14.9,8.2 v14.7,8.4 | IC1.17 | v15.15,11.25 R10.1
  PWR 0.254: v15.15,11.25 15.15,8.85 v14.7,8.4
N$11
  Top 0.254: DL3.A 25.6,7.6 24.3,6.3 R12.1
N$12
  Top 0.254: DL4.A 24.05,7.1 23.3,6.35 R13.1
RESETN  (via drill 0.19)
  Top 0.203: v26.4,6.35 27.04,6.35 27.13,6.44 27.46,6.44 27.77,6.75 U1.40
  Top 0.254: PB1.6 10.82,11.23 C2.1 10.82,14.12 11.36,14.66 15.85,14.66 R4.1 16,14.15 v16.15,14
  MID 0.254: 34.3,2.8 40.45,2.8 41.53,3.88 41.53,12.72 38.95,15.3 35.5,15.3 JP3.3 | 34.3,2.8 32.76,2.8 31.53,4.03 28.02,4.03 26.4,5.65 v26.4,6.35 26.15,6.6 25.3,6.6 23.52,8.38 23.52,9.03 18.88,13.68 18.77,13.68 18.77,13.67 16.48,13.67 v16.15,14 | JP2.13 34.3,2.8
RX0  (via drill 0.2)
  Top 0.254: v37.6,5.5 37.6,5.52 37.51,5.61 | 37.51,5.61 Q1.6 | R17.1 37.4,5.61 37.51,5.61 | U1.9 35.2,7.18 v35.2,7.46
  MID 0.254: v35.2,7.46 37.34,7.46 37.6,7.2 37.8,7 37.8,5.7 v37.6,5.5
RX1  (via drill 0.19)
  Top 0.254: U1.17 35.26,11.38 34.74,10.86 34.6,10.86 v34.43,10.68
  Bottom 0.254: JP3.2 36.83,13.03 34.48,10.68 v34.43,10.68
RX_D11  (via drill 0.19, 0.2)
  Top 0.254: U3.16 20.3,11.95 21.01,12.66 22.46,12.66 23.5,11.61 v23.5,11.4 | DL3.C v25.6,9.7 | R14.1 39.4,6.95 Q1.4 38.15,7.09 37.44,7.09 v37.15,6.8
  MID 0.254: v23.5,11.4 23.52,11.38 23.52,10.77 25.6,8.69 | 25.6,8.69 29.35,4.94 34.9,4.94 36.76,6.8 v37.15,6.8 | v25.6,9.7 25.6,8.69
RX_UPDI  (via drill 0.19, 0.2)
  Top 0.254: U3.12 23,10.45 23.4,10.85 24.35,10.85 v24.45,10.95 | R7.2 36.06,12.62 v36.06,13.35
  PWR 0.254: v24.45,10.95 24.9,11.4 27.3,11.4 30.4,14.5 33.15,14.5 34.38,13.27 36.1,13.27 36.06,13.32 v36.06,13.35
SCK  (via drill 0.2)
  Top 0.254: R3.2 5.25,2.71 JP2.1 | v29.39,10.76 28.8,10.76 U1.32
  PWR 0.254: v29.39,10.76 28.86,10.22 28.86,6.37 27.66,5.17 20,5.17 v19.95,5.22
  Bottom 0.254: v19.95,5.22 19.88,5.14 7.69,5.14 6.38,3.83 6.37,3.83 JP2.1
TX0  (via drill 0.2)
  Top 0.254: Q1.3 39.9,6 | 39.9,6 40.46,6.57 R15.1 | v40.27,5.73 40,6 39.9,6 | U1.8 34.67,7.02 34.67,7.68 35.28,8.3 v35.5,8.3
  MID 0.254: v35.5,8.3 35.9,8.7 37.9,8.7 40.2,6.4 40.2,5.8 v40.27,5.73
TX1  (via drill 0.19)
  Top 0.254: v34.88,10.24 35.29,10.65 35.29,10.68 35.63,11.02 U1.16
  Bottom 0.254: JP3.1 38.36,16.51 37.92,16.07 37.92,16.06 37.29,15.42 37.29,12.79 34.93,10.43 34.93,10.29 v34.88,10.24
TX_D11  (via drill 0.19, 0.2)
  Top 0.254: U3.15 20.8,11.8 21.2,12.2 22.22,12.2 22.6,11.82 22.6,11.8 22.8,11.6 v22.8,11.57 | DL4.C | DL4.C v24.05,8.7 | Q1.1 38.4,4.51 37.89,4.51 R16.1 36.51,4.13 v36.38,4.27
  MID 0.254: v22.8,11.57 22.97,11.4 22.97,10.57 24.05,9.49 | 24.05,9.49 29.06,4.49 36.16,4.49 v36.38,4.27 | v24.05,8.7 24.05,9.49
TX_UPDI  (via drill 0.19, 0.2)
  Top 0.203: R20.1 39.2,11.74 Q2.1 39.61,12.11 v40.2,12.7 | v40.8,14.6 v40.8,14.61 D3.A
  Top 0.254: U3.11 23.15,9.95 23.37,10.17 v24.87,10.17 | 38,12.5 37.39,13.11 R7.1 37.65,13.93 R18.1 | 38,12.5 v38.04,12.54 | Q2.1 39.26,12.11 39.11,11.96 38.54,11.96 38,12.5
  PWR 0.254: v24.87,10.17 24.87,10.57 25.22,10.92 27.47,10.92 30.59,14.04 32.96,14.04 34.19,12.82 37.76,12.82 v38.04,12.54
  Bottom 0.203: v40.2,12.7 40.8,13.3 v40.8,14.6
UPDI  (via drill 0.19, 0.2)
  Top 0.203: R20.2 38.33,10.83 Q2.6
  Top 0.254: U1.41 28.65,6.88 28.65,7.45 28.9,7.7 29.19,7.7 29.63,7.7 v30.4,7.7 | R19.1 39.43,10.83 Q2.6 38.2,10.74 v38.2,10.3
  MID 0.254: v30.4,7.7 33.09,7.7 35.4,10.02 37.92,10.02 v38.2,10.3
  Bottom 0.203: J2.4 41.11,9.59 41.11,9.88 40.58,10.41 39.82,10.41 39.71,10.3 v38.2,10.3
USB_N  (via drill 0.19)
  Top 0.203: J1.2 3.36,9.54 3.35,9.55 v3.38,9.55
  Top 0.254: 8.2,9.49 18.54,9.49 U3.21 | 8.2,9.49 4.36,9.49 J1.2 | D1.3 8.18,9.51 8.2,9.49
  Bottom 0.203: D-.X 2.59,13.54 2.59,10.34 v3.38,9.55
USB_P  (via drill 0.19)
  Top 0.203: U3.22 18.5,8.97 | v3.38,8.9 J1.3
  Top 0.254: 8.2,8.94 18.77,8.94 18.8,8.97 18.5,8.97 | 8.2,8.94 4.36,8.94 J1.3 | D1.2 8.18,8.92 8.2,8.94
  Bottom 0.203: D+.X 1.78,10.42 3.3,8.9 v3.38,8.9
VIN  (via drill 0.19)
  Top 0.254: R10.2 v16.75,10.6
  Top 0.305: IC1.16 15.4,8.15 v15.53,8.27
  Top 0.61: C4.1 42.35,7.17 v42.35,7.15
  PWR 0.254: v16.75,10.6 16.75,9.5 v15.53,8.27
  PWR 0.61: JP2.15 39.82,1.27 42.35,3.8 v42.35,7.15 | v15.53,8.27 19.3,4.5 33.15,4.5 v34,3.65
  Bottom 0.61: v34,3.65 35.11,2.54 38.1,2.54 JP2.15
VUSB
  Top 0.406: J1.1 6.12,10.19 D1.4 6.28,10.95 6.28,12.94 D2.A

### Text on the board
test-probe: 5V | VIN(5V) | VCC | GND | RESET | 14 | 13 | 12 | 11 | 10 | 9 | 8 | 7 | 6 | USB_5V | USB_D- | SWCLK | SWDIO | JGND | JRST | VTG | BATT+ | BATT- | USB_D+ | USB_GND | AREF | A0 | A1 | A2 | A3 | A4 | A5 | A6 | 0 | 1 | 2 | 3 | 4 | 5